# EAGLE schematic SparkFun_DataLogger_IoT_9DOF (EAGLE 9.6.2)
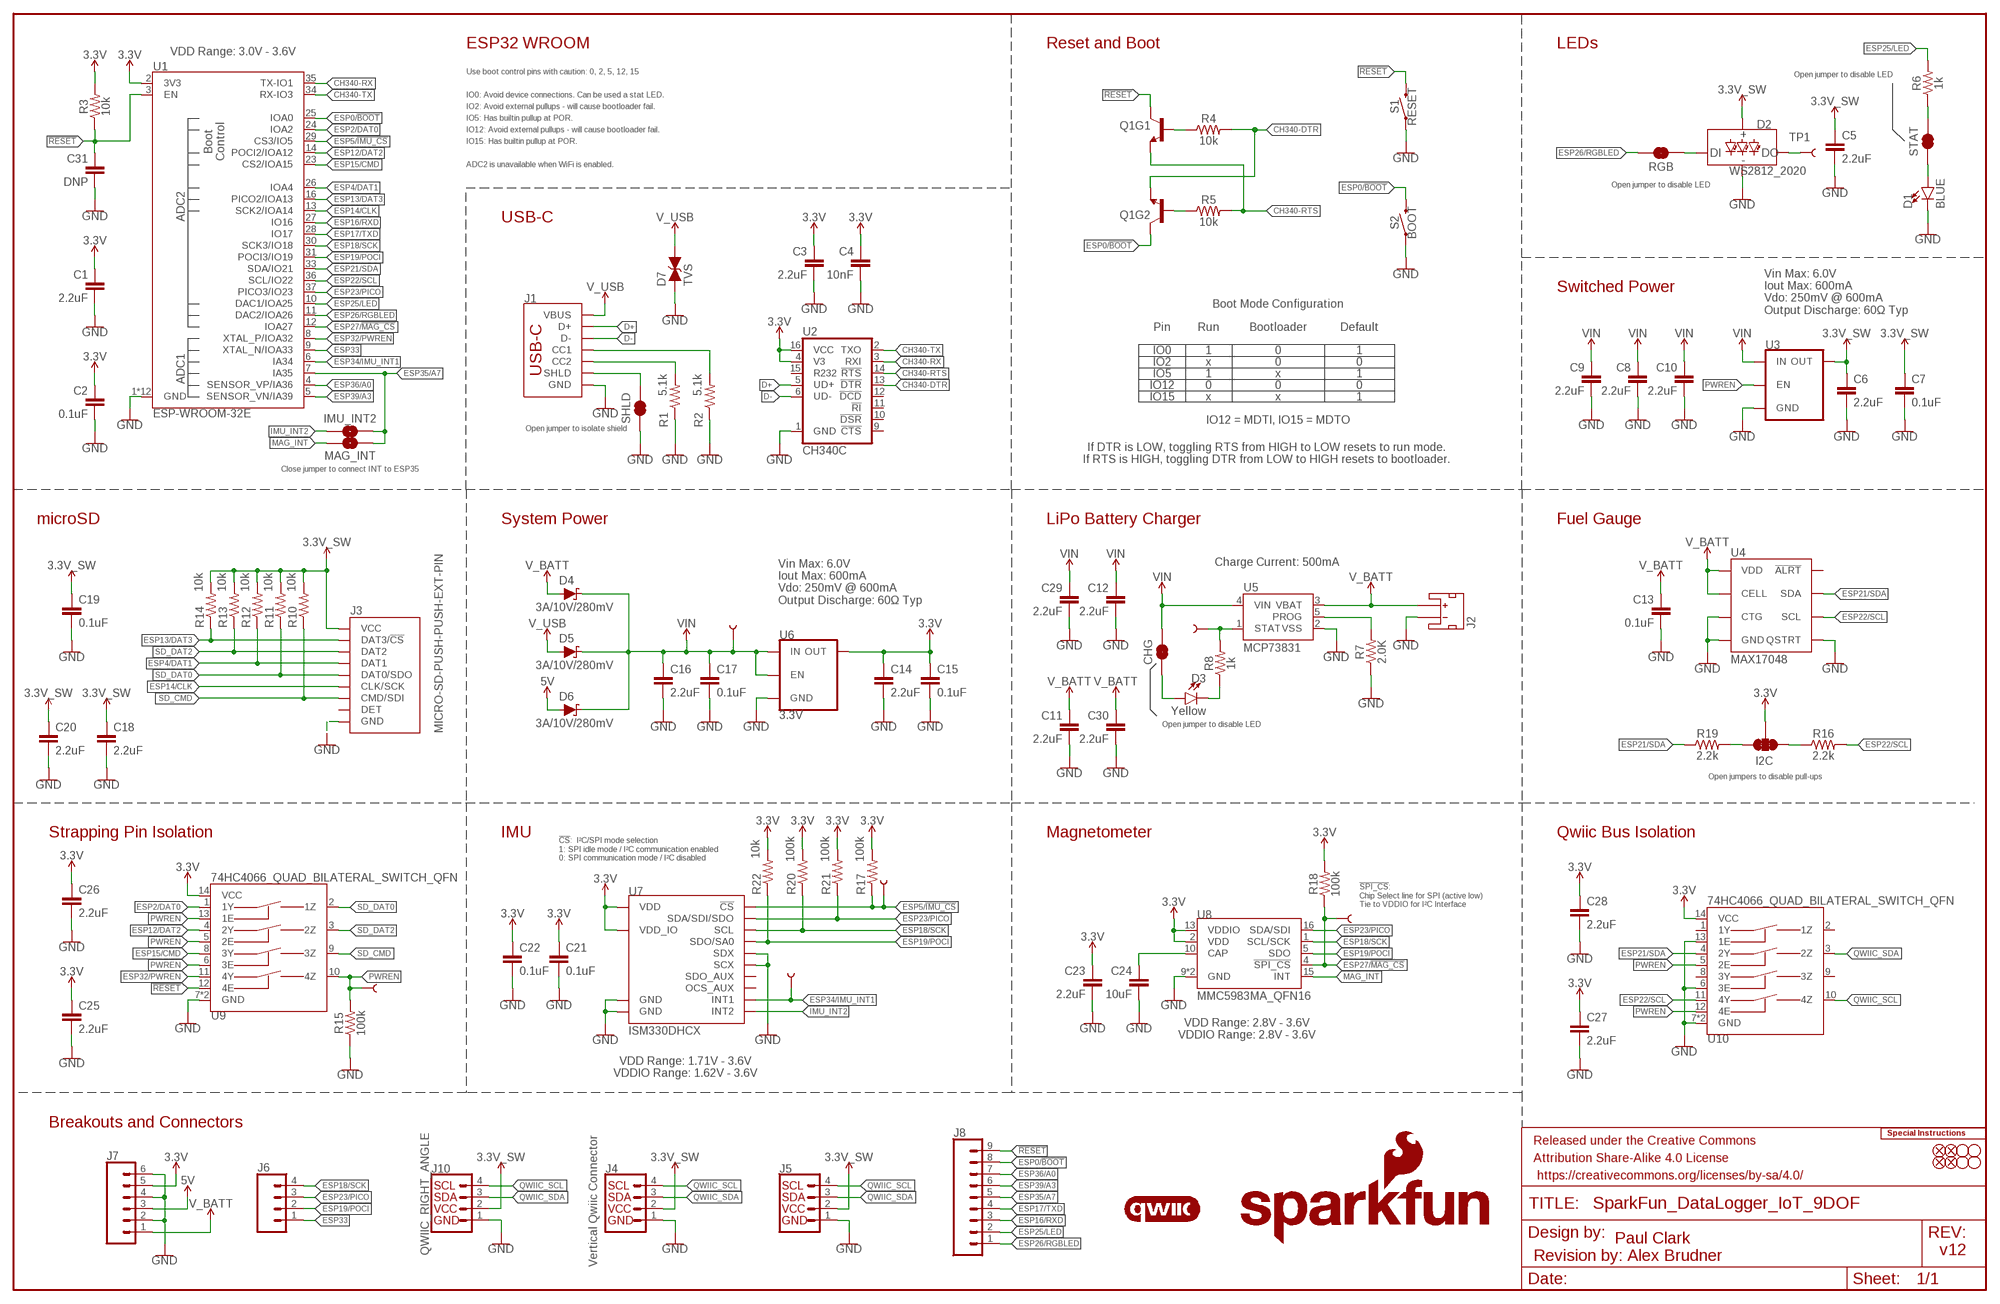
[diagram p0: schematic, sheet 1]

## Parts
C1  2.2uF  2.2UF-0402_TIGHT-10V-10%-X5R  [0402-TIGHT]
C2  0.1uF  0.1UF-0402T-6.3V-10%-X7R  [0402-TIGHT]
C3  2.2uF  2.2UF-0402_TIGHT-10V-10%-X5R  [0402-TIGHT]
C4  10nF  10NF-0402T-25V-10%-X7R-WE  [0402-TIGHT]
C5  2.2uF  2.2UF-0402_TIGHT-10V-10%-X5R  [0402-TIGHT]
C6  2.2uF  2.2UF-0402_TIGHT-10V-10%-X5R  [0402-TIGHT]
C7  0.1uF  0.1UF-0402T-6.3V-10%-X7R  [0402-TIGHT]
C8  2.2uF  2.2UF-0402_TIGHT-10V-10%-X5R  [0402-TIGHT]
C9  2.2uF  2.2UF-0402_TIGHT-10V-10%-X5R  [0402-TIGHT]
C10  2.2uF  2.2UF-0402_TIGHT-10V-10%-X5R  [0402-TIGHT]
C11  2.2uF  2.2UF-0402_TIGHT-10V-10%-X5R  [0402-TIGHT]
C12  2.2uF  2.2UF-0402_TIGHT-10V-10%-X5R  [0402-TIGHT]
C13  0.1uF  0.1UF-0402T-6.3V-10%-X7R  [0402-TIGHT]
C14  2.2uF  2.2UF-0402_TIGHT-10V-10%-X5R  [0402-TIGHT]
C15  0.1uF  0.1UF-0402T-6.3V-10%-X7R  [0402-TIGHT]
C16  2.2uF  2.2UF-0402_TIGHT-10V-10%-X5R  [0402-TIGHT]
C17  0.1uF  0.1UF-0402T-6.3V-10%-X7R  [0402-TIGHT]
C18  2.2uF  2.2UF-0402_TIGHT-10V-10%-X5R  [0402-TIGHT]
C19  0.1uF  0.1UF-0402T-6.3V-10%-X7R  [0402-TIGHT]
C20  2.2uF  2.2UF-0402_TIGHT-10V-10%-X5R  [0402-TIGHT]
C21  0.1uF  0.1UF-0402T-6.3V-10%-X7R  [0402-TIGHT]
C22  0.1uF  0.1UF-0402T-6.3V-10%-X7R  [0402-TIGHT]
C23  2.2uF  2.2UF-0402_TIGHT-10V-10%-X5R  [0402-TIGHT]
C24  10uF  10UF-0402T-6.3V-20%  [0402-TIGHT]
C25  2.2uF  2.2UF-0402_TIGHT-10V-10%-X5R  [0402-TIGHT]
C26  2.2uF  2.2UF-0402_TIGHT-10V-10%-X5R  [0402-TIGHT]
C27  2.2uF  2.2UF-0402_TIGHT-10V-10%-X5R  [0402-TIGHT]
C28  2.2uF  2.2UF-0402_TIGHT-10V-10%-X5R  [0402-TIGHT]
C29  2.2uF  2.2UF-0402_TIGHT-10V-10%-X5R  [0402-TIGHT]
C30  2.2uF  2.2UF-0402_TIGHT-10V-10%-X5R  [0402-TIGHT]
C31  DNP  DNP-0402-TIGHT_NO_CREAM  [0402-TIGHT_NO_CREAM]
CHG  JUMPER-SMT_2_NC_TRACE_SILK  [SMT-JUMPER_2_NC_TRACE_SILK]
D1  BLUE  LED-BLUE0603  [LED-0603]
D2  WS2812_2020  [WS2812-2020]
D3  Yellow  LED-YELLOW0603  [LED-0603]
D4  3A/10V/280mV  DIODE-SCHOTTKY-BAT60A  [SOD-323]
D5  3A/10V/280mV  DIODE-SCHOTTKY-BAT60A  [SOD-323]
D6  3A/10V/280mV  DIODE-SCHOTTKY-BAT60A  [SOD-323]
D7  TVS  DIODE_TVS  [0603]
FD1  FIDUCIAL1X2  [FIDUCIAL-1X2]
FD2  FIDUCIAL1X2  [FIDUCIAL-1X2]
FD3  FIDUCIAL1X2  [FIDUCIAL-1X2]
FD4  FIDUCIAL1X2  [FIDUCIAL-1X2]
FRAME1  FRAME-LEDGER  [CREATIVE_COMMONS]
H1  STAND-OFFTIGHT  [STAND-OFF-TIGHT]
H2  STAND-OFFTIGHT  [STAND-OFF-TIGHT]
H3  STAND-OFFTIGHT  [STAND-OFF-TIGHT]
H4  STAND-OFFTIGHT  [STAND-OFF-TIGHT]
I2C  JUMPER-SMT_3_2-NC_TRACE_SILK  [SMT-JUMPER_3_2-NC_TRACE_SILK]
IMU_!CS!  TEST-POINT3X5  [PAD.03X.05]
IMU_INT1  TEST-POINT3X5  [PAD.03X.05]
IMU_INT2  JUMPER-SMT_2_NO_SILK  [SMT-JUMPER_2_NO_SILK]
J1  USB_C_4-LAYER_PADS  [USB-C-16P_4LAYER-PADS]
J2  JST_2MM_MALE  [JST-2-SMD]
J3  MICRO-SD-PUSH-PUSH-EXT-PIN  [MICROSD-EXTERNALPIN]
J4  Vertical Qwiic Connector  QWIIC_CONNECTOR  [JST04_1MM_VERT]
J5  I2C_STANDARD_NO_SILK  [1X04_NO_SILK]
J6  CONN_041X04_NO_SILK_NO_POP  [1X04_NO_SILK]
J7  CONN_06NO_SILK_NO_POP  [1X06_NO_SILK]
J8  CONN_09NO_SILK  [1X09_NO_SILK]
J10  QWIIC_RIGHT_ANGLE  QWIIC_CONNECTORJS-1MM  [JST04_1MM_RA]
LOGO1  SPECIAL_INSTRUCTIONS-ORDERING  [ORDERING_INSTRUCTIONS]
LOGO3  QWIIC_LOGO_6MM  [QWIIC_6MM]
LOGO5  SFE_LOGO_NAME.2_INCH  [SFE_LOGO_NAME_.2]
LOGO6  SFE_LOGO_FLAME.2_INCH  [SFE_LOGO_FLAME_.2]
MAG_!CS!  TEST-POINT3X5  [PAD.03X.05]
MAG_INT  JUMPER-SMT_2_NO_SILK  [SMT-JUMPER_2_NO_SILK]
PWREN  TEST-POINT3X5  [PAD.03X.05]
Q1  TRANS_NPN_DUAL-MBT3904DW1T1  [SC70-6]
R1  5.1k  5.1KOHM-0402T-1/16W-1%  [0402-TIGHT]
R2  5.1k  5.1KOHM-0402T-1/16W-1%  [0402-TIGHT]
R3  10k  10KOHM-0402T-1/16W-1%  [0402-TIGHT]
R4  10k  10KOHM-0402T-1/16W-1%  [0402-TIGHT]
R5  10k  10KOHM-0402T-1/16W-1%  [0402-TIGHT]
R6  1k  1KOHM-0402T-1/16W-1%  [0402-TIGHT]
R7  2.0K  2.0KOHM-0402T-1/16W-1%  [0402-TIGHT]
R8  1k  1KOHM-0402T-1/16W-1%  [0402-TIGHT]
R10  10k  10KOHM-0402T-1/16W-1%  [0402-TIGHT]
R11  10k  10KOHM-0402T-1/16W-1%  [0402-TIGHT]
R12  10k  10KOHM-0402T-1/16W-1%  [0402-TIGHT]
R13  10k  10KOHM-0402T-1/16W-1%  [0402-TIGHT]
R14  10k  10KOHM-0402T-1/16W-1%  [0402-TIGHT]
R15  100k  100KOHM-0402T-1/16W-1%  [0402-TIGHT]
R16  2.2k  2.2KOHM-0402T-1/16W-1%  [0402-TIGHT]
R17  100k  100KOHM-0402T-1/16W-1%  [0402-TIGHT]
R18  100k  100KOHM-0402T-1/16W-1%  [0402-TIGHT]
R19  2.2k  2.2KOHM-0402T-1/16W-1%  [0402-TIGHT]
R20  100k  100KOHM-0402T-1/16W-1%  [0402-TIGHT]
R21  100k  100KOHM-0402T-1/16W-1%  [0402-TIGHT]
R22  10k  10KOHM-0402T-1/16W-1%  [0402-TIGHT]
RGB  JUMPER-SMT_2_NC_TRACE_SILK  [SMT-JUMPER_2_NC_TRACE_SILK]
S1  RESET  MOMENTARY-SWITCH-SPST-SMD-RIGHT-ANGLE  [TACTILE_SWITCH_SMD_RIGHT_ANGLE]
S2  BOOT  MOMENTARY-SWITCH-SPST-SMD-RIGHT-ANGLE  [TACTILE_SWITCH_SMD_RIGHT_ANGLE]
SHLD  JUMPER-SMT_2_NC_TRACE_SILK  [SMT-JUMPER_2_NC_TRACE_SILK]
STAT  JUMPER-SMT_2_NC_TRACE_SILK  [SMT-JUMPER_2_NC_TRACE_SILK]
TP1  TEST-POINT3X5  [PAD.03X.05]
U1  ESP-WROOM-32E  ESP-WROOM-3232D-NARROW  [ESP-WROOM-32D-NARROW]
U2  CH340C  [SO016]
U3  3.3V  V_REG_AP2112K-3.3V  [SOT23-5]
U4  MAX17048  MAX17048DFN8  [DFN-8]
U5  MCP73831  [SOT23-5]
U6  3.3V  V_REG_AP2112K-3.3V  [SOT23-5]
U7  ISM330DHCX  [LGA-14L]
U8  MMC5983MA_QFN16  [LGA-16-3X3MM-4X4PINS]
U9  74HC4066_QUAD_BILATERAL_SWITCH_QFN  [14-QFN]
U10  74HC4066_QUAD_BILATERAL_SWITCH_QFN  [14-QFN]
VIN  TEST-POINT3X5  [PAD.03X.05]
VIN1  TEST-POINT3X5  [PAD.03X.05]

## Nets
3.3V: C1.1 C2.1 C3.1 C4.1 C14.1 C15.1 C21.1 C22.1 C23.1 C25.1 C26.1 C27.1 C28.1 I2C.2 J7.5 R3.2 R17.2 R18.2 R20.2 R21.2 R22.2 U1.2(3V3) U2.4(V3) U2.16(VCC) U6.5(OUT) U7.P5(VDD_IO) U7.P8(VDD) U8.2(VDD) U8.13(VDDIO) U9.14(VCC) U10.14(VCC)
3.3V_SW: C5.1 C6.1 C7.1 C18.1 C19.1 C20.1 D2.VCC J3.4(VCC) J4.2 J5.2 J10.2 R10.2 R11.2 R12.2 R13.2 R14.2 U3.5(OUT)
5V: D6.A J7.3
!RESET!: C31.1 J8.9 Q1.3(C) R3.1 S1.2 U1.3(EN) U9.12(4E)
CAP: C24.1 U8.10(CAP)
CH340-DTR: Q1.1(E) R4.2 U2.13(!DTR)
CH340-RTS: Q1.4(E) R5.2 U2.14(!RTS)
CH340-RX: U1.35(TX-IO1) U2.3(RXI)
CH340-TX: U1.34(RX-IO3) U2.2(TXO)
D+: J1.A6(D+) J1.B6(D+) U2.5(UD+)
D-: J1.A7(D-) J1.B7(D-) U2.6(UD-)
ESP0/!BOOT!: J8.8 Q1.6(C) S2.2 U1.25(IOA0)
ESP2/DAT0: U1.24(IOA2) U9.1(1Y)
ESP4/DAT1: J3.8(DAT1) R12.1 U1.26(IOA4)
ESP5/!IMU_CS!: IMU_!CS!.1 R17.1 U1.29(CS3/IO5) U7.P12(!CS!)
ESP12/DAT2: U1.14(POCI2/IOA12) U9.4(2Y)
ESP13/DAT3: J3.2(DAT3/!CS!) R14.1 U1.16(PICO2/IOA13)
ESP14/CLK: J3.5(CLK/SCK) U1.13(SCK2/IOA14)
ESP15/CMD: U1.23(CS2/IOA15) U9.8(3Y)
ESP16/RXD: J8.3 U1.27(IO16)
ESP17/TXD: J8.4 U1.28(IO17)
ESP18/SCK: J6.4 R20.1 U1.30(SCK3/IO18) U7.P13(SCL) U8.1(SCL/SCK)
ESP19/POCI: J6.2 R22.1 U1.31(POCI3/IO19) U7.P1(SDO/SA0) U8.5(SDO)
ESP21/SDA: R19.1 U1.33(SDA/IO21) U4.8(SDA) U10.4(2Y)
ESP22/SCL: R16.2 U1.36(SCL/IO22) U4.7(SCL) U10.11(4Y)
ESP23/PICO: J6.3 R21.1 U1.37(PICO3/IO23) U7.P14(SDA/SDI/SDO) U8.16(SDA/SDI)
ESP25/LED: J8.2 R6.2 U1.10(DAC1/IOA25)
ESP26/RGBLED: J8.1 RGB.2 U1.11(DAC2/IOA26)
ESP27/!MAG_CS!: MAG_!CS!.1 R18.1 U1.12(IOA27) U8.4(!SPI_CS!)
ESP32/PWREN: U1.8(XTAL_P/IOA32) U9.11(4Y)
ESP33: J6.1 U1.9(XTAL_N/IOA33)
ESP34/IMU_INT1: IMU_INT1.1 U1.6(IA34) U7.P4(INT1)
ESP35/A7: IMU_INT2.2 J8.5 MAG_INT.2 U1.7(IA35)
ESP36/A0: J8.7 U1.4(SENSOR_VP/IA36)
ESP39/A3: J8.6 U1.5(SENSOR_VN/IA39)
GND: C1.2 C2.2 C3.2 C4.2 C5.2 C6.2 C7.2 C8.2 C9.2 C10.2 C11.2 C12.2 C13.2 C14.2 C15.2 C16.2 C17.2 C18.2 C19.2 C20.2 C21.2 C22.2 C23.2 C24.2 C25.2 C26.2 C27.2 C28.2 C29.2 C30.2 C31.2 D1.C D2.GND D7.1(A) J1.GND J1.GND2(GND) J2.1(-) J3.6(GND) J3.10(GND) J3.11(GND) J3.12(GND) J3.13(GND) J4.1 J5.1 J7.2 J7.4 J7.6 J10.1 R1.1 R2.1 R7.1 R15.1 S1.1 S2.1 SHLD.1 U1.1(GND) U1.15(GND) U1.38(GND) U1.GND1(GND) U1.GNDT1(GND) U1.GNDT2(GND) U1.GNDT3(GND) U1.GNDT4(GND) U1.GNDT5(GND) U1.GNDT6(GND) U1.GNDT7(GND) U1.GNDT8(GND) U2.1(GND) U3.2(GND) U4.1(CTG) U4.4(GND) U4.6(QSTRT) U4.9(GND) U5.2(VSS) U6.2(GND) U7.P2(SDX) U7.P3(SCX) U7.P6(GND) U7.P7(GND) U8.9(GND) U8.11(GND) U9.7(GND) U9.EPAD(GND) U10.6(3E) U10.7(GND) U10.13(1E) U10.EPAD(GND)
IMU_INT2: IMU_INT2.1 U7.P9(INT2)
MAG_INT: MAG_INT.1 U8.15(INT)
N$1: J1.B5(CC2) R1.2
N$2: J1.A5(CC1) R2.2
N$4: Q1.2(B) R5.1
N$5: Q1.5(B) R4.1
N$6: R6.1 STAT.2
N$7: D2.DO TP1.1
N$8: CHG.1 D3.A
N$9: D3.C R8.1
N$10: R8.2 U5.1(STAT) VIN1.1
N$11: R7.2 U5.5(PROG)
N$12: D2.DI RGB.1
N$13: D1.A STAT.1
N$16: I2C.1 R16.1
N$17: I2C.3 R19.2
PWREN: PWREN.1 R15.2 U3.3(EN) U9.5(2E) U9.6(3E) U9.10(4Z) U9.13(1E) U10.5(2E) U10.12(4E)
QWIIC_SCL: J4.4 J5.4 J10.4 U10.10(4Z)
QWIIC_SDA: J4.3 J5.3 J10.3 U10.3(2Z)
SD_CMD: J3.3(CMD/SDI) R10.1 U9.9(3Z)
SD_DAT0: J3.7(DAT0/SDO) R11.1 U9.2(1Z)
SD_DAT2: J3.1(DAT2) R13.1 U9.3(2Z)
SHIELD: J1.SHLD1(SHLD) J1.SHLD2(SHLD) J1.SHLD3(SHLD) J1.SHLD4(SHLD) SHLD.2
V_BATT: C11.1 C13.1 C30.1 D4.A J2.2(+) J7.1 U4.2(CELL) U4.3(VDD) U5.3(VBAT)
V_USB: D5.A D7.2(C) J1.VBUS1(VBUS) J1.VBUS2(VBUS)
VIN: C8.1 C9.1 C10.1 C12.1 C16.1 C17.1 C29.1 CHG.2 D4.C D5.C D6.C U3.1(IN) U5.4(VIN) U6.1(IN) U6.3(EN) VIN.1
Unconnected: J2.NC1(PAD1) J2.NC2(PAD2) J3.9(DET) U2.9(!CTS) U2.10(!DSR) U2.11(!RI) U2.12(!DCD) U2.15(R232) U4.5(!ALRT) U7.P10(OCS_AUX) U7.P11(SDO_AUX) U10.1(1Y) U10.2(1Z) U10.8(3Y) U10.9(3Z)

## Notes on the sheet
- VDD Range: 3.0V - 3.6V | ESP32 WROOM | Reset and Boot | LEDs
- Use boot control pins with caution: 0, 2, 5, 12, 15
- Open jumper to disable LED
- IO0: Avoid device connections. Can be used a stat LED.
- IO2: Avoid external pullups - will cause bootloader fail.
- IO5: Has builtin pullup at POR.
- IO12: Avoid external pullups - will cause bootloader fail.
- IO15: Has builtin pullup at POR.
- ADC2 is unavailable when WiFi is enabled.
- Open jumper to disable LED
- USB-C
- Switched Power
- Boot Mode Configuration
- Vin Max: 6.0V
  Iout Max: 600mA
  Vdo: 250mV @ 600mA
  Output Discharge: 60Ω Typ
- Pin | Run | Bootloader | Default
- IO0 | 1 | 0 | 1
- IO2 | x | 0 | 0
- IO5 | 1 | x | 1
- IO12 | 0 | 0 | 0
- IO15 | x | x | 1
- IO12 = MDTI, IO15 = MDTO
- Open jumper to isolate shield
- If DTR is LOW, toggling RTS from HIGH to LOW resets to run mode.
  If RTS is HIGH, toggling DTR from LOW to HIGH resets to bootloader.
- Close jumper to connect INT to ESP35
- microSD | System Power | LiPo Battery Charger | Fuel Gauge
- Charge Current: 500mA
- Vin Max: 6.0V
  Iout Max: 600mA
  Vdo: 250mV @ 600mA
  Output Discharge: 60Ω Typ
- Open jumper to disable LED
- Open jumpers to disable pull-ups
- Strapping Pin Isolation | IMU | Magnetometer | Qwiic Bus Isolation
- !CS!:  I²C/SPI mode selection
  1: SPI idle mode / I²C communication enabled
  0: SPI communication mode / I²C disabled
- !SPI_CS!:
  Chip Select line for SPI (active low) 
  Tie to VDDIO for I²C Interface
- VDD Range: 2.8V - 3.6V
  VDDIO Range: 2.8V - 3.6V
- VDD Range: 1.71V - 3.6V
  VDDIO Range: 1.62V - 3.6V
- Breakouts and Connectors
- Paul Clark
- v12
- Revision by: Alex Brudner

## Library data of the parts
C1 C3 C5 C6 C8-C12 C14 C16 C18 C20 C23 C25-C30 = SparkFun-Capacitors:2.2UF: 2.2µF ceramic capacitors A capacitor is a passive two-terminal electrical component used to store electrical energy temporarily in an electric field.; PROD_ID: CAP-14232
C2 C7 C13 C15 C17 C19 C21 C22 = SparkFun-Capacitors:0.1UF: 0.1µF ceramic capacitors A capacitor is a passive two-terminal electrical component used to store electrical energy temporarily in an electric field.; PROD_ID: CAP-14993
C4 = SparkFun-Capacitors:10NF: 0.01uF/10nF/10,000pF ceramic capacitors A capacitor is a passive two-terminal electrical component used to store electrical energy temporarily in an electric field. CAP-09321; PROD_ID: CAP-16508
C24 = SparkFun-Capacitors:10UF: 10.0µF ceramic capacitors A capacitor is a passive two-terminal electrical component used to store electrical energy temporarily in an electric field.; PROD_ID: CAP-14848
C31 = SparkFun-Capacitors:DNP: Do-Not-Populate capacitor
CHG RGB SHLD STAT = SparkFun-Jumpers:JUMPER-SMT_2_NC_TRACE: Normally closed trace jumper This jumper has a trace between two pads so it's normally closed (NC). Use a razor knife to open the connection. For best results follow the IPC guidelines for cutting traces: Cutout at least 0.063 mm (0.005 in). Remove all loose material to clean up the cut area. Seal the cut with an approved epoxy. Reapply solder to reclose the connection.
D1 = SparkFun-LED:LED-BLUE: Blue SMD LED Used in manufacturing of various products at SparkFun Packages: 0603 - SMD 0603 package [Product Link] <http://www.digikey.com/product-detail/en/SMLE12BC7TT86/511-1589-2-ND/1641808> 1206 - SMD1206 package [Product Link] <http://www.digikey.com/product-detail/en/lite-on-inc/LTST-C150TBKT/160-1643-1-ND/573584> SparkFun Products: ESP8266 Thing-Dev Board <https://www.sparkfun.com/products/13711> RedBoard <https://www.sparkfun.com/products/12757>; PROD_ID: DIO-08575
D2 = SparkFun-LED:WS2812: Addressable RGB LED - 1 Wire Common names: WS2812, SK6812, Neopixel, APA-106, etc. SMD LED with built-in controller IC. Color: Red/Green/Blue SparkFun Products: LED-SMD RGB (WS2812) <https://www.sparkfun.com/products/11821> LED - RGB Addressable, PTH, 5mm Diffused (5 Pack) <https://www.sparkfun.com/products/12986> LED - RGB Addressable, PTH, 5mm Clear (5 Pack) <https://www.sparkfun.com/products/12999> Blynk Board - ESP8266 <https://www.sparkfun.com/products/13794> Datasheet referenced for footprint: WS2812B-PTH <https://cdn.sparkfun.com/datasheets/Components/LED/COM-12877.pdf>; PROD_ID: DIO-15591
D3 = SparkFun-LED:LED-YELLOW: Yellow SMD LED Used in manufacturing several products at SparkFun. Packages: 0603 - SMD 0603 package[Product Link] <http://www.kingbrightusa.com/product.asp?catalog_name=LED&product_id=APT1608SYCK> 0603 -SMART - SMART SMD 0603 package (more efficient/more expensive) [Product Link] <http://www.osram-os.com/osram_os/en/products/product-catalog/led-light-emitting-diodes/smartled-0603/ly-l29k/index.jsp> LilyPad - SMD1206 package[Product Datasheet] <https://www.sparkfun.com/datasheets/DevTools/LilyPad/Q150YUS4.pdf> SparkFun Products: Blynk Board <https://www.sparkfun.com/products/13794> IOIO-OTG <https://www.sparkfun.com/products/13613> XBee Explorer Serial <https://www.sparkfun.com/products/13225>; PROD_ID: DIO-09003
D4-D6 = SparkFun-DiscreteSemi:DIODE-SCHOTTKY: Schottky diode A Schottky diode is a semiconductor diode which has a low forward voltage drop and a very fast switching action.; PROD_ID: DIO-14072
D7 = SparkFun-DiscreteSemi:DIODE_TVS; PROD_ID: DIO-14502; VALUE: 24V
FD1-FD4 = SparkFun-Aesthetics:FIDUCIAL: Fiducial Alignment Points Point-of-reference for pick-and-place machines and other optical instruments.
FRAME1 = SparkFun-Aesthetics:FRAME-LEDGER: Schematic Frame - Ledger Standard 11x14 US Ledger frame
H1-H4 = SparkFun-Hardware:STAND-OFF: Stand Off Drill holes for mechanically mounting via screws, standoffs, etc. Note: Use the keepout ring to avoid running the screw head into surrounding components. Variant Overviews STAND-OFF - Mechanical footprint for a #4 phillips button head screw. STAND-OFF-TIGHT - Mechanical footprint for a #4 phillips button head screw, Example SparkFun Products Screw - Phillips Head (1/4", 4-40, 10 pack) <https://www.sparkfun.com/products/10453> (PRT-10453) Screw - Phillips Head (1/2", 4-40, 10 pack) <https://www.sparkfun.com/products/10452> (PRT-10452) Screw - Phillips Head (3/4", 4-40, 10 pack) <https://www.sparkfun.com/products/10451> (PRT-10451) Screw - Phillips Head (1", 4-40, 10 pack) <https://www.sparkfun.com/products/10450> (PRT-10450)
I2C = SparkFun-Jumpers:JUMPER-SMT_3_2-NC_TRACE: Normally closed trace jumper (2 of 2 connections) This jumper has a trace between all three pads so they are normally closed (NC). Use a razor knife to open the connection(s). For best results follow the IPC guidelines for cutting traces: Cutout at least 0.063 mm (0.005 in). Remove all loose material to clean up the cut area. Seal the cut with an approved epoxy. Reapply solder to reclose the connection(s).
IMU_!CS! IMU_INT1 MAG_!CS! PWREN TP1 VIN VIN1 = SparkFun-Connectors:TEST-POINT: SparkFun Test Points Bare copper test points for troubleshooting or In-Circuit-Testing. These are used by our Production team for verifying production board runs using pogo-pins on test beds. SparkFun Products: SparkFun LSM9DS1 Breakout <https://www.sparkfun.com/products/13284> SparkFun PSOC <https://www.sparkfun.com/products/13714> SparkFun Load Cell Amplifier <https://www.sparkfun.com/products/13879>
IMU_INT2 MAG_INT = SparkFun-Jumpers:JUMPER-SMT_2_NO: Normally open jumper This jumper has two pads in close proximity to each other. Apply solder to close the connection. Round pads are easier to solder for beginners, but are a lot larger. SparkFun Product that uses the round pads: SparkFun EL Sequencer <https://www.sparkfun.com/products/12781>
J1 = SparkFun-Connectors:USB_C: USB Type C 16Pin Connector Super Speed pins not available on the 16-pin purely SMD connector so this part is best for USB 2.0 implementations. D1 and D2 are tied together enabling D+/- no matter which way the cable is plugged into the connector. The two channel configuration pins (CC1/2) are exposed. These are normally connected to ground via 5.1k resistors but can be reconfigured for high current/high power applications. **4-LAYER BOARD WARNING!!** If designing 4-layer board, make sure to select the variant _4-LAYER-ISOLATED. The linked footprint (USB-C-16-4LAYER-ISOLATED) includes some very necessary cutout polygons in the inner layers (2 and 15). This prevents the PTH mounting shield legs on the USB connector from electrically connecting any other polygons on the inner layers (usually VCC and GND).; PROD_ID: CONN-14122
J2 = SparkFun-Connectors:JST_2MM_MALE: JST 2MM MALE RA CONNECTOR Two pin, compact surface mount connector. Commonly used as a battery input connection point. We really like the solid locking feeling and high current rating on these small connectors. We use these all the time as battery connectors. Mates to single-cell LiPo batteries. Here is the connector we sell at SparkFun: JST Right Angle Connector - White <https://www.sparkfun.com/products/8612> (PRT-08612) Datasheet <http://www.sparkfun.com/datasheets/Prototyping/Connectors/JST-Horizontal.pdf> It was used on these SparkFun products: SparkFun MOSFET Power Controller <https://www.sparkfun.com/products/11214> (PRT-11214) SparkFun Battery Babysitter - LiPo Battery Manager <https://www.sparkfun.com/products/13777> (PRT-13777) And many, many others that required a lipo battery connection.; PROD_ID: CONN-11443; SF_ID: PRT-08612
J3 = SparkFun-Connectors:MICRO-SD: microSD Socket for Transflash Various sockets for µSD. tDoc lines correctly indicate media card edge positions when inserting (unlocked, locked, depressed). NOTE: CD1 and CD2 are connected internally, and the default detect state of the socket is detect pin to ground. SparkFun Products: WAV Trigger <https://www.sparkfun.com/products/13660> CAN-Bus Shield <https://www.sparkfun.com/products/13262> SparkFun Level Shifing microSD Breakout <https://www.sparkfun.com/products/13743>; PROD_ID: CONN-16110
J4 = SparkFun-Connectors:QWIIC_CONNECTOR: SparkFun I2C Standard Qwiic Connector An SMD 1mm pitch JST connector makes it easy and quick (get it? Qwiic?) to connect I2C devices to each other. The Qwiic system <http://www.sparkfun.com/qwiic> enables fast and solderless connection between popular platforms and various sensors and actuators. We carry 200mm <https://www.sparkfun.com/products/14204>, 100mm <https://www.sparkfun.com/products/14205>, 50mm <https://www.sparkfun.com/products/14206>, and breadboard friendly <https://www.sparkfun.com/products/14207> Qwiic cables. We also offer 10 pcs strips <https://www.sparkfun.com/products/14323> the SMD connectors.; PROD_ID: CONN-14483
J5 = SparkFun-Connectors:I2C_STANDARD: SparkFun I2C Standard Pinout Header SparkFun has standardized on a pinout for all I2C based sensor breakouts. This pinout allows I2C boards to be plugged directly into the headers on Arduino Uno compatible boards, and to be daisy chained easily. Example SparkFun Products: SparkFun Atmospheric Sensor Breakout - BME280 <https://www.sparkfun.com/products/13676> SparkFun Altitude/Pressure Sensor Breakout - MPL3115A2 <https://www.sparkfun.com/products/11084> SparkFun TOF Range Finder Sensor - VL6180 <https://www.sparkfun.com/products/12785>
J6 = SparkFun-Connectors:CONN_04: Multi connection point. Often used as Generic Header-pin footprint for 0.1 inch spaced/style header connections On any of the 0.1 inch spaced packages, you can populate with these: Break Away Headers - Straight <https://www.sparkfun.com/products/116> (PRT-00116) Break Away Male Headers - Right Angle <https://www.sparkfun.com/products/553> (PRT-00553) Female Headers <https://www.sparkfun.com/products/115> (PRT-00115) Break Away Headers - Machine Pin <https://www.sparkfun.com/products/117> (PRT-00117) Break Away Female Headers - Swiss Machine Pin <https://www.sparkfun.com/products/743> (PRT-00743) For SCREWTERMINALS and SPRING TERMINALS visit here: Screw Terimnals on SparkFun.com <https://www.sparkfun.com/search/results?term=Screw+Terminals> (5mm/3.5mm/2.54mm spacing) This device is also useful as a general connection point to wire up your design to another part of your project. Our various solder wires solder well into these plated through hole pads. Hook-Up Wire - Assortment (Stranded, 22 AWG) <https://www.sparkfun.com/products/11375> (PRT-11375) Hook-Up Wire - Assortment (Solid Core, 22 AWG) <https://www.sparkfun.com/products/11367> (PRT-11367) View the entire wire category on our website here <https://www.sparkfun.com/categories/141> Special notes: Molex polarized connector foot print use with SKU : PRT-08231 with associated crimp pins and housings. 1MM SMD Version SKU: PRT-10208
J7 = SparkFun-Connectors:CONN_06: Multi connection point. Often used as Generic Header-pin footprint for 0.1 inch spaced/style header connections On any of the 0.1 inch spaced packages, you can populate with these: Break Away Headers - Straight <https://www.sparkfun.com/products/116> (PRT-00116) Break Away Male Headers - Right Angle <https://www.sparkfun.com/products/553> (PRT-00553) Female Headers <https://www.sparkfun.com/products/115> (PRT-00115) Break Away Headers - Machine Pin <https://www.sparkfun.com/products/117> (PRT-00117) Break Away Female Headers - Swiss Machine Pin <https://www.sparkfun.com/products/743> (PRT-00743) Arduino Stackable Header - 6 Pin <https://www.sparkfun.com/products/9280> (PRT-09280) For SCREWTERMINALS and SPRING TERMINALS visit here: Screw Terimnals on SparkFun.com <https://www.sparkfun.com/search/results?term=Screw+Terminals> (5mm/3.5mm/2.54mm spacing) This device is also useful as a general connection point to wire up your design to another part of your project. Our various solder wires solder well into these plated through hole pads. Hook-Up Wire - Assortment (Stranded, 22 AWG) <https://www.sparkfun.com/products/11375> (PRT-11375) Hook-Up Wire - Assortment (Solid Core, 22 AWG) <https://www.sparkfun.com/products/11367> (PRT-11367) View the entire wire category on our website here <https://www.sparkfun.com/categories/141>
J8 = SparkFun-Connectors:CONN_09: Multi connection point. Often used as Generic Header-pin footprint for 0.1 inch spaced/style header connections On any of the 0.1 inch spaced packages, you can populate with these: Break Away Headers - Straight <https://www.sparkfun.com/products/116> (PRT-00116) Break Away Male Headers - Right Angle <https://www.sparkfun.com/products/553> (PRT-00553) Female Headers <https://www.sparkfun.com/products/115> (PRT-00115) Break Away Headers - Machine Pin <https://www.sparkfun.com/products/117> (PRT-00117) Break Away Female Headers - Swiss Machine Pin <https://www.sparkfun.com/products/743> (PRT-00743) For SCREWTERMINALS and SPRING TERMINALS visit here: Screw Terimnals on SparkFun.com <https://www.sparkfun.com/search/results?term=Screw+Terminals> (5mm/3.5mm/2.54mm spacing) This device is also useful as a general connection point to wire up your design to another part of your project. Our various solder wires solder well into these plated through hole pads. Hook-Up Wire - Assortment (Stranded, 22 AWG) <https://www.sparkfun.com/products/11375> (PRT-11375) Hook-Up Wire - Assortment (Solid Core, 22 AWG) <https://www.sparkfun.com/products/11367> (PRT-11367) View the entire wire category on our website here <https://www.sparkfun.com/categories/141> Special notes: Molex polarized connector foot print use with SKU : PRT-08231 with associated crimp pins and housings. 1MM SMD Version SKU: PRT-10208 NOTES ON THE VARIANTS LOCK and LOCK_LONGPADS... This footprint was designed to help hold the alignment of a through-hole component (i.e. 6-pin header) while soldering it into place. You may notice that each hole has been shifted either up or down by 0.005 of an inch from it's more standard position (which is a perfectly straight line). This slight alteration caused the pins (the squares in the middle) to touch the edges of the holes. Because they are alternating, it causes a "brace" to hold the component in place. 0.005 has proven to be the perfect amount of "off-center" position when using our standard breakaway headers. Although looks a little odd when you look at the bare footprint, once you have a header in there, the alteration is very hard to notice. Also,if you push a header all the way into place, it is covered up entirely on the bottom side.
J10 = SparkFun-Connectors:QWIIC_CONNECTOR: SparkFun I2C Standard Qwiic Connector An SMD 1mm pitch JST connector makes it easy and quick (get it? Qwiic?) to connect I2C devices to each other. The Qwiic system <http://www.sparkfun.com/qwiic> enables fast and solderless connection between popular platforms and various sensors and actuators. We carry 200mm <https://www.sparkfun.com/products/14204>, 100mm <https://www.sparkfun.com/products/14205>, 50mm <https://www.sparkfun.com/products/14206>, and breadboard friendly <https://www.sparkfun.com/products/14207> Qwiic cables. We also offer 10 pcs strips <https://www.sparkfun.com/products/14323> the SMD connectors.; PROD_ID: CONN-13694
LOGO1 = SparkFun-Aesthetics:SPECIAL_INSTRUCTIONS: Special Ordering/Production Instructions Alert Symbol for special PCB ordering instructions or unique production process warnings. Ordering Instructions Production Instructions Types of information that should be added to box: Copper weight Soldermask color Silk color PCB thickness Number of layers PCB Standard: 1.6mm FR4 1 oz copper immersion silver plating red soldermask white silkscreen Types of information that should be added to box: Special wash requirements Depaneling instructions Humidification Glue curing Default text settings: 0.07 inch 9% ratio 50% line distance
LOGO3 = SparkFun-Aesthetics:QWIIC_LOGO: Qwiic Logos for placement on schematic and PCB. The 5.5mm silk logo is best for placing next to Qwiic connector.
LOGO5 = SparkFun-Aesthetics:SFE_LOGO_NAME: SparkFun Font Logo This is the SparkFun name logo. The logo on the schematic will always be the same size; the package variant is the height of the flame part of the logo (or the height the flame would be, if it were drawn). Default layer for the logo on the board is tSilk.
LOGO6 = SparkFun-Aesthetics:SFE_LOGO_FLAME: SparkFun Flame Logo This is the SparkFun flame logo. The logo on the schematic will always be the same size; the package variant is the height of the flame. Default layer for the logo on the board is tSilk.
Q1 = SparkFun-DiscreteSemi:TRANS_NPN_DUAL: Dual NPN Transistors in Single Package The MBT3904W1 puts two general purpose 3904 NPN transistors in a single package. Datasheet <http://www.onsemi.com/pub_link/Collateral/MBT3904DW1T1-D.PDF> SparkFun Products: SparkFun ESP32 Thing <https://www.sparkfun.com/products/13907>; PROD_ID: TRANS-13337
R1 R2 = SparkFun-Resistors:5.1KOHM; PROD_ID: RES-14340
R3-R5 R10-R14 R22 = SparkFun-Resistors:10KOHM: 10kΩ resistor A resistor is a passive two-terminal electrical component that implements electrical resistance as a circuit element. Resistors act to reduce current flow, and, at the same time, act to lower voltage levels within circuits. - Wikipedia; PROD_ID: RES-14241
R6 R8 = SparkFun-Resistors:1KOHM: 1kΩ resistor A resistor is a passive two-terminal electrical component that implements electrical resistance as a circuit element. Resistors act to reduce current flow, and, at the same time, act to lower voltage levels within circuits. - Wikipedia; PROD_ID: RES-14342
R7 = SparkFun-Resistors:2.0KOHM: 2kΩ resistor A resistor is a passive two-terminal electrical component that implements electrical resistance as a circuit element. Resistors act to reduce current flow, and, at the same time, act to lower voltage levels within circuits. - Wikipedia; PROD_ID: RES-15406
R15 R17 R18 R20 R21 = SparkFun-Resistors:100KOHM: 100kΩ resistor A resistor is a passive two-terminal electrical component that implements electrical resistance as a circuit element. Resistors act to reduce current flow, and, at the same time, act to lower voltage levels within circuits. - Wikipedia; PROD_ID: RES-13495
R16 R19 = SparkFun-Resistors:2.2KOHM: 2.2kΩ resistor A resistor is a passive two-terminal electrical component that implements electrical resistance as a circuit element. Resistors act to reduce current flow, and, at the same time, act to lower voltage levels within circuits. - Wikipedia; PROD_ID: RES-14341
S1 S2 = SparkFun-Switches:MOMENTARY-SWITCH-SPST: Momentary Switch (Pushbutton) - SPST Normally-open (NO) SPST momentary switches (buttons, pushbuttons). Variants PTH-12MM - 12mm square, through-hole Momentary Pushbutton Switch - 12mm Square <https://www.sparkfun.com/products/9190> (COM-09190) PTH-6.0MM, PTH-6.0MM-KIT - 6.0mm square, through-hole Mini Pushbutton Switch <https://www.sparkfun.com/products/97> (COM-00097) KIT package intended for soldering kit's - only one side of pads' copper is exposed. PTH-RIGHT-ANGLE-KIT - Right-angle, through-hole Right Angle Tactile Button <https://www.sparkfun.com/products/10791> - Used on SparkFun BigTime Watch Kit <https://www.sparkfun.com/products/11734> SMD-12MM - 12mm square, surface-mount Tactile Button - SMD (12mm) <https://www.sparkfun.com/products/12993> (COM-12993) Used on SparkFun PicoBoard <https://www.sparkfun.com/products/11888> SMD-4.5MM - 4.5mm Square Trackball Switch Used on SparkFun Blackberry Trackballer Breakout <https://www.sparkfun.com/products/13169> SMD-4.6MMX2.8MM - 4.60mm x 2.80mm, surface mount Used on SparkFun Pro Micro - RP2040 <https://www.sparkfun.com/products/17717> SMD-5.2MM, SMD-5.2-REDUNDANT - 5.2mm square, surface-mount Mini Pushbutton Switch - SMD <https://www.sparkfun.com/products/8720> (COM-08720) Used on Arduino Pro Mini <https://www.sparkfun.com/products/11114> REDUNDANT package connects both switch circuits together SMD-6.0X3.5MM - 6.0 x 3.5mm, surface mount Momentary Reset Switch SMD <https://www.sparkfun.com/products/8229> (COM-08229) SMD-6.2MM-TALL - 6.2mm square, surface mount Tactile Button - SMD (6mm) <https://www.sparkfun.com/products/12992> Used on SparkFun Digital Sandbox <https://www.sparkfun.com/products/12651> SMD-RIGHT-ANGLE - Right-angle, surface mount Used on SparkFun Block for Intel® Edison - Arduino <https://www.sparkfun.com/products/13036>; PROD_ID: COMP-12265
U1 = SparkFun-RF:ESP-WROOM-32: ESP-WROOM-32D - trace antenna (includes keepout) ESP-WROOM-32U - U.FL antenna connector Includes both "standard" footprints and "narrow" version (for use with tighter layouts).; PROD_ID: IC-15676
U2 = SparkFun-IC-Comms:CH340C; PROD_ID: IC-14038
U3 U6 = SparkFun-IC-Power:V_REG_AP2112: AP2112 - 600mA CMOS LDO Regulator w/ Enable The AP2112 is CMOS process low dropout linear regulator with enable function, the regulator delivers a guaranteed 600mA (min.) continuous load current. Features Output Voltage Accuracy: ±1.5% Output Current: 600mA (Min.) Foldback Short Current Protection: 50mA Enable Function to Turn ON/OFF VOUT Low Dropout Voltage (3.3V): 250mV (Typ.) @IOUT=600mA Excellent Load Regulation: 0.2%/A (Typ.) Excellent Line Regulation: 0.02%/V (Typ.) Low Quiescent Current: 55μA (Typ.) Low Standby Current: 0.01μA (Typ.) Low Output Noise: 50μVRMS PSRR: 100Hz -65dB, 1kHz -65dB OTSD Protection Stable with 1.0μF Flexible Cap: Ceramic, Tantalum and Aluminum Electrolytic Operation Temperature Range: -40°C to 85°C ESD: MM 400V, HBM 4000V; PROD_ID: VREG-12457
U4 = SparkFun-IC-Power:MAX17048: Micropower 1-Cell Li+ ModelGauge SparkFun Products Qduino Mini <https://www.sparkfun.com/products/13614> (DEV-13614); PROD_ID: IC-12551
U5 = SparkFun-IC-Power:MCP73831: MCP73831T Li-Ion, Li-Pol Controller Miniature single cell, fully integrated Li-Ion, Li-polymer charge management controller Datasheet <http://ww1.microchip.com/downloads/en/DeviceDoc/20001984g.pdf> SparkFun Products: SparkFun ESP32 Thing <https://www.sparkfun.com/products/13907> SparkFun 9DoF Razor IMU M0 <https://www.sparkfun.com/products/14001>; PROD_ID: IC-09995
U7 = SparkFun-Sensors:ISM330DHCX: ISM330DHCX 6DoF The ISM330DHCX is a system-in-package featuring a high-performance 3D digital accelerometer and 3D digital gyroscope tailored for Industry 4.0 applications.; PROD_ID: IC-16693
U8 = SparkFun-Sensors:MMC5983MA: High Performance 3-axis Magnetic Sensor The MMC5983MA is an AEC-Q100 qualified complete 3-axis magnetic sensor with on-chip signal processing and integrated I2C/SPI bus suitable for use in automotive applications. The device can be connected directly to a microprocessor, eliminating the need for A/D converters or timing resources. It can measure magnetic fields within the full scale range of ±8 Gauss (G), with 0.25mG/0.0625mG per LSB resolution at 16bits/18bits operation mode and 0.4 mG total RMS noise level, enabling heading accuracy of ±0.5° in electronic compass applications.; PROD_ID: IC-16314
U9 U10 = SparkFun-IC-Logic:74HC4066_QUAD_BILATERAL_SWITCH: Nexperia Quad Bilateral Switch The 74HC4066 is a quad single pole, single throw analog switch. Each switch features two input/output terminals (nY and nZ) and an active HIGH enable input (nE). When nE is LOW, the analog switch is turned off. Inputs include clamp diodes. This enables the use of current limiting resistors to interface inputs to voltages in excess of VCC. Datasheet <https://assets.nexperia.com/documents/data-sheet/74HC_HCT4066.pdf>; PROD_ID: IC-16528